# EAGLE schematic xdac+power_A (EAGLE 8.4.3)
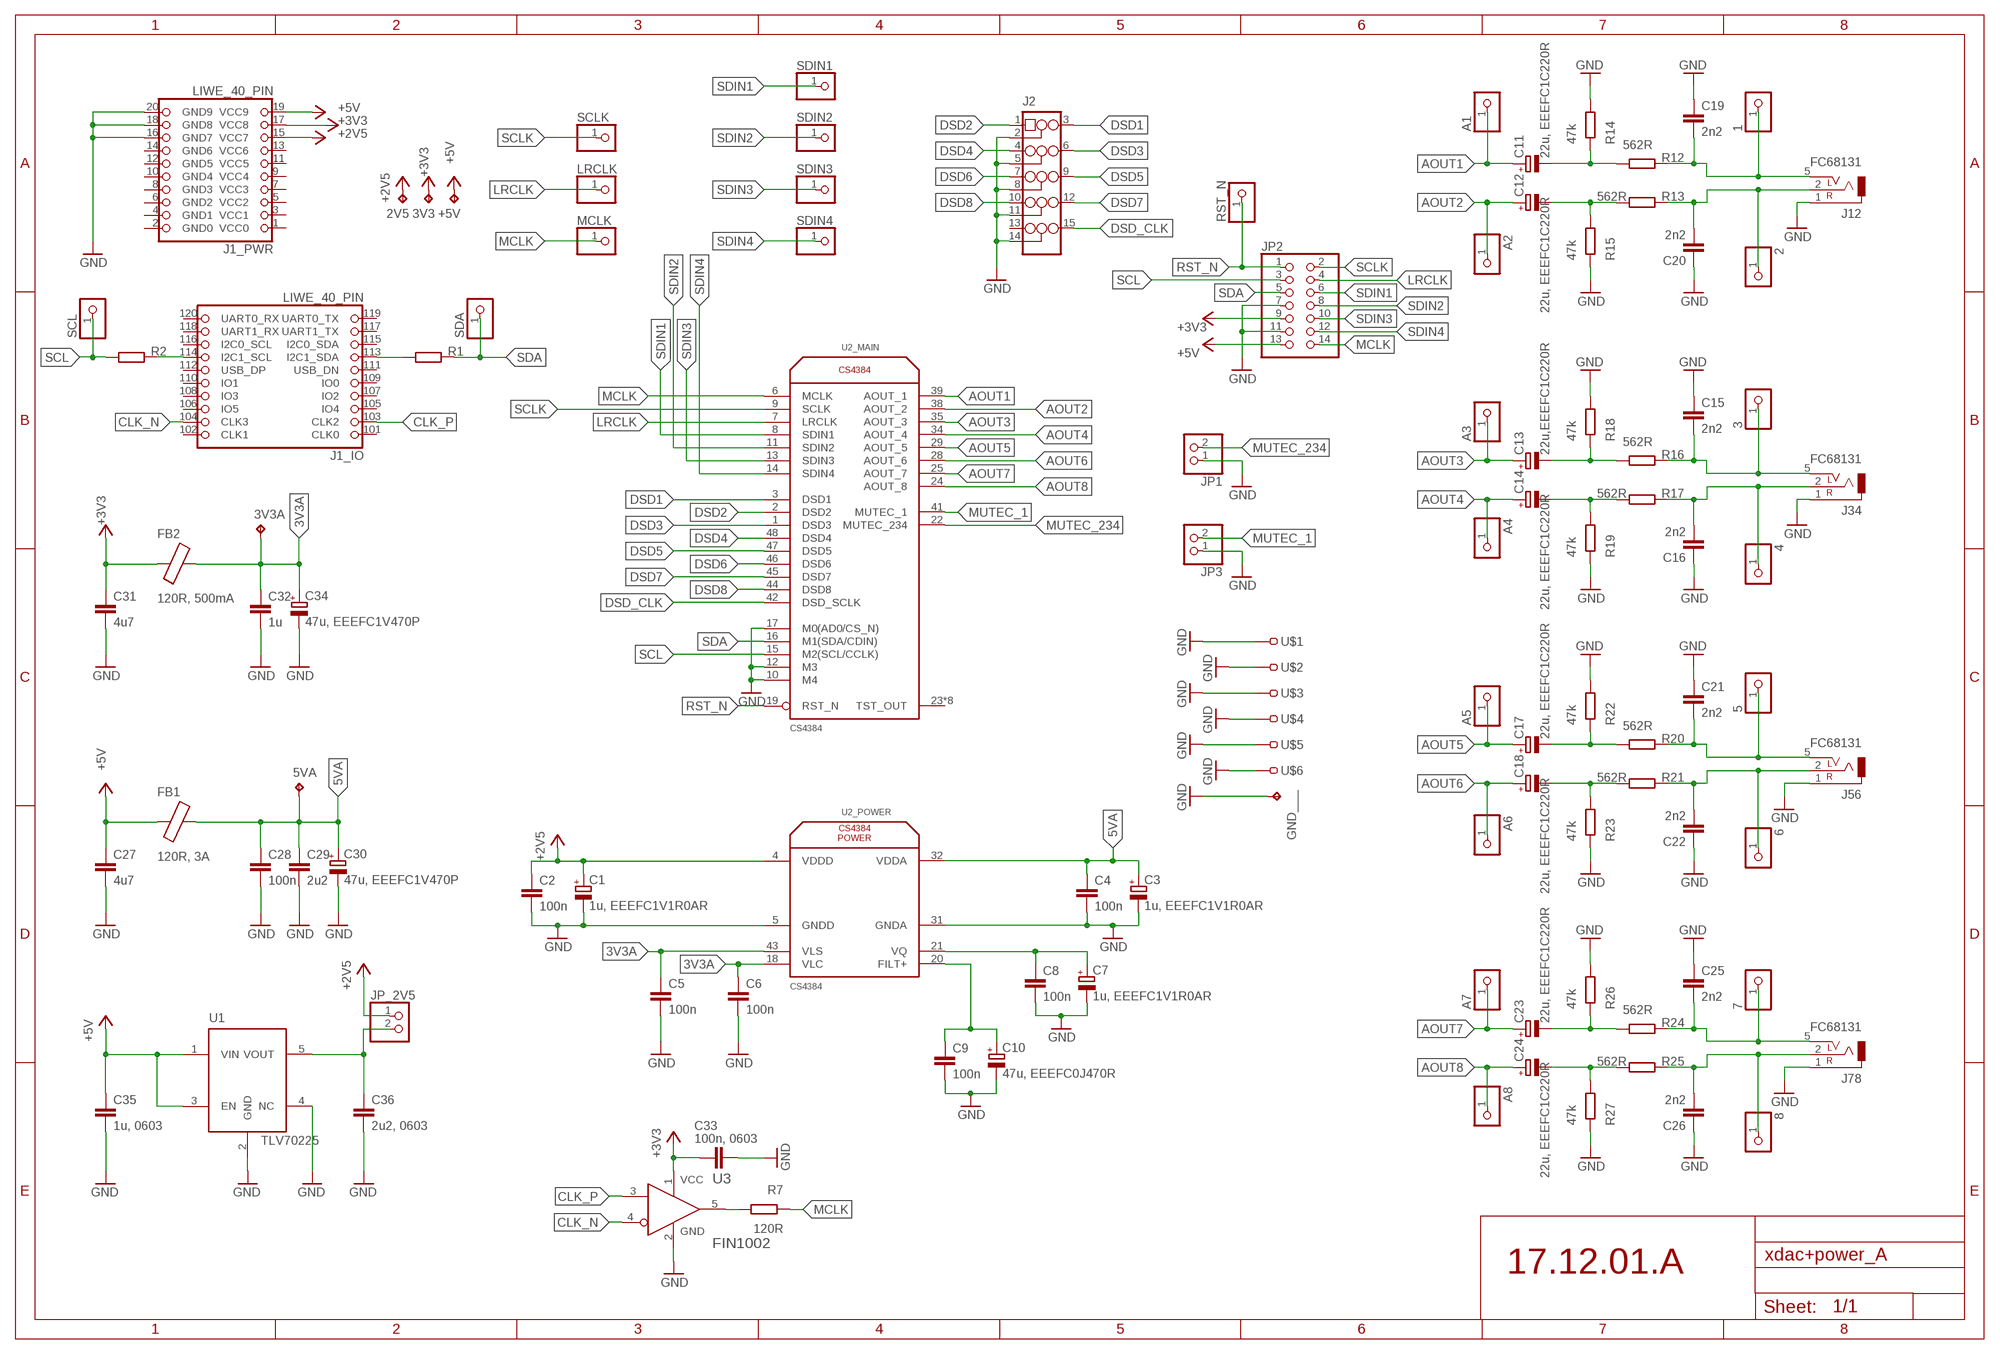
[diagram p0: schematic, sheet 1]

## Parts
1  PINHD-1X1  [1X01]
2  PINHD-1X1  [1X01]
2V5  TPTP14R  [TP14R]
3  PINHD-1X1  [1X01]
3V3  TPTP14R  [TP14R]
3V3A  TPTP14R  [TP14R]
4  PINHD-1X1  [1X01]
5  PINHD-1X1  [1X01]
5VA  TPTP14R  [TP14R]
6  PINHD-1X1  [1X01]
7  PINHD-1X1  [1X01]
8  PINHD-1X1  [1X01]
+5V  TPTP14R  [TP14R]
A1  PINHD-1X1  [1X01]
A2  PINHD-1X1  [1X01]
A3  PINHD-1X1  [1X01]
A4  PINHD-1X1  [1X01]
A5  PINHD-1X1  [1X01]
A6  PINHD-1X1  [1X01]
A7  PINHD-1X1  [1X01]
A8  PINHD-1X1  [1X01]
C1  1u, EEEFC1V1R0AR  C-POL_B  [EEE-FC1V1R0AR]
C2  100n  C-EUC0603  [C0603]
C3  1u, EEEFC1V1R0AR  C-POL_B  [EEE-FC1V1R0AR]
C4  100n  C-EUC0603  [C0603]
C5  100n  C-EUC0603  [C0603]
C6  100n  C-EUC0603K  [C0603K]
C7  1u, EEEFC1V1R0AR  C-POL_B  [EEE-FC1V1R0AR]
C8  100n  C-EUC0603  [C0603]
C9  100n  C-EUC0603  [C0603]
C10  47u, EEEFC0J470R  C-POL_C  [EEE-FC1C220R]
C11  22u, EEEFC1C220R  C-POL_C  [EEE-FC1C220R]
C12  22u, EEEFC1C220R  C-POL_C  [EEE-FC1C220R]
C13  22u,EEEFC1C220R  C-POL_C  [EEE-FC1C220R]
C14  22u, EEEFC1C220R  C-POL_C  [EEE-FC1C220R]
C15  2n2  C-EUC0603  [C0603]
C16  2n2  C-EUC0603  [C0603]
C17  22u, EEEFC1C220R  C-POL_C  [EEE-FC1C220R]
C18  22u, EEEFC1C220R  C-POL_C  [EEE-FC1C220R]
C19  2n2  C-EUC0603  [C0603]
C20  2n2  C-EUC0603  [C0603]
C21  2n2  C-EUC0603  [C0603]
C22  2n2  C-EUC0603  [C0603]
C23  22u, EEEFC1C220R  C-POL_C  [EEE-FC1C220R]
C24  22u, EEEFC1C220R  C-POL_C  [EEE-FC1C220R]
C25  2n2  C-EUC0603  [C0603]
C26  2n2  C-EUC0603  [C0603]
C27  4u7  C-EUC0603K  [C0603K]
C28  100n  C-EUC0603K  [C0603K]
C29  2u2  C-EUC0603K  [C0603K]
C30  47u, EEEFC1V470P  C-POL_E  [EEE-FC1V470P]
C31  4u7  C-EUC0603K  [C0603K]
C32  1u  C-EUC0603K  [C0603K]
C33  100n, 0603  C-EUC0603  [C0603]
C34  47u, EEEFC1V470P  C-POL_E  [EEE-FC1V470P]
C35  1u, 0603  C-EUC0603  [C0603]
C36  2u2, 0603  C-EUC0603  [C0603]
FB1  120R, 3A  FB_0603  [L0603]
FB2  120R, 500mA  FB_0603  [L0603]
GND___  TPTP14R  [TP14R]
J1  LIWE_40_PIN  [LIWE_40_PIN_8X8]
J2  PINHD-3X5/90  [3X05/90]
J12  FC68131  JACK_3.5_3P  [FC68131]
J34  FC68131  JACK_3.5_3P  [FC68131]
J56  FC68131  JACK_3.5_3P  [FC68131]
J78  FC68131  JACK_3.5_3P  [FC68131]
JP1  PINHD-1X2/90  [1X02/90]
JP2  PINHD-2X7  [2X07]
JP3  PINHD-1X2/90  [1X02/90]
JP_2V5  PINHD-1X2  [1X02]
LRCLK  PINHD-1X1  [1X01]
MCLK  PINHD-1X1  [1X01]
R1  R-EU_R0603  [R0603]
R2  R-EU_R0603  [R0603]
R7  120R  R-EU_R0603  [R0603]
R12  562R  R-EU_R0603  [R0603]
R13  562R  R-EU_R0603  [R0603]
R14  47k  R-EU_R0603  [R0603]
R15  47k  R-EU_R0603  [R0603]
R16  562R  R-EU_R0603  [R0603]
R17  562R  R-EU_R0603  [R0603]
R18  47k  R-EU_R0603  [R0603]
R19  47k  R-EU_R0603  [R0603]
R20  562R  R-EU_R0603  [R0603]
R21  562R  R-EU_R0603  [R0603]
R22  47k  R-EU_R0603  [R0603]
R23  47k  R-EU_R0603  [R0603]
R24  562R  R-EU_R0603  [R0603]
R25  562R  R-EU_R0603  [R0603]
R26  47k  R-EU_R0603  [R0603]
R27  47k  R-EU_R0603  [R0603]
RST_N  PINHD-1X1  [1X01]
SCL  PINHD-1X1  [1X01]
SCLK  PINHD-1X1  [1X01]
SDA  PINHD-1X1  [1X01]
SDIN1  PINHD-1X1  [1X01]
SDIN2  PINHD-1X1  [1X01]
SDIN3  PINHD-1X1  [1X01]
SDIN4  PINHD-1X1  [1X01]
U1  TLV70225  TLV702  [SOT-23-5]
U2  CS4384  [LQFP_48]
U3  FIN1002  [SOT95P280X140-5N]
U$1  TEST-22-MULTICOMP  [TEST_1MM]
U$2  TEST-22-MULTICOMP  [TEST_1MM]
U$3  TEST-22-MULTICOMP  [TEST_1MM]
U$4  TEST-22-MULTICOMP  [TEST_1MM]
U$5  TEST-22-MULTICOMP  [TEST_1MM]
U$6  TEST-22-MULTICOMP  [TEST_1MM]

## Nets
2V5_OUT: C36.1 JP_2V5.2 U1.5(VOUT)
3V3A: 3V3A.TP C5.1 C6.1 C32.1 C34.1(+) FB2.1 U2.18(_POWER:VLC) U2.43(_POWER:VLS)
5VA: 5VA.TP C3.1(+) C4.1 C28.1 C29.1 C30.1(+) FB1.1 U2.32(_POWER:VDDA)
+2V5: 2V5.TP C1.1(+) C2.1 J1.15(_PWR:VCC7) JP_2V5.1 U2.4(_POWER:VDDD)
+3V3: 3V3.TP C31.1 C33.2 FB2.2 J1.17(_PWR:VCC8) JP2.9 U3.1(VCC)
+5V: +5V.TP C27.1 C35.1 FB1.2 J1.19(_PWR:VCC9) JP2.13 U1.1(VIN) U1.3(EN)
AOUT1: A1.1 C11.1(+) U2.39(_MAIN:AOUT_1)
AOUT2: A2.1 C12.1(+) U2.38(_MAIN:AOUT_2)
AOUT2_: 2.1 C20.2 J12.2 R13.2
AOUT3: A3.1 C13.1(+) U2.35(_MAIN:AOUT_3)
AOUT3_: 3.1 C15.2 J34.5 R16.2
AOUT4: A4.1 C14.1(+) U2.34(_MAIN:AOUT_4)
AOUT4_: 4.1 C16.2 J34.2 R17.2
AOUT5: A5.1 C17.1(+) U2.29(_MAIN:AOUT_5)
AOUT5_: 5.1 C21.2 J56.5 R20.2
AOUT6: A6.1 C18.1(+) U2.28(_MAIN:AOUT_6)
AOUT6_: 6.1 C22.2 J56.2 R21.2
AOUT7: A7.1 C23.1(+) U2.25(_MAIN:AOUT_7)
AOUT7_: 7.1 C25.2 J78.5 R24.2
AOUT8: A8.1 C24.1(+) U2.24(_MAIN:AOUT_8)
AOUT8_: 8.1 C26.2 J78.2 R25.2
AUOT1_: 1.1 C19.2 J12.5 R12.2
CLK_N: J1.104(_IO:CLK3) U3.4(RIN-)
CLK_P: J1.103(_IO:CLK2) U3.3(RIN+)
DSD1: J2.3 U2.3(_MAIN:DSD1)
DSD2: J2.1 U2.2(_MAIN:DSD2)
DSD3: J2.6 U2.1(_MAIN:DSD3)
DSD4: J2.4 U2.48(_MAIN:DSD4)
DSD5: J2.9 U2.47(_MAIN:DSD5)
DSD6: J2.7 U2.46(_MAIN:DSD6)
DSD7: J2.12 U2.45(_MAIN:DSD7)
DSD8: J2.10 U2.44(_MAIN:DSD8)
DSD_CLK: J2.15 U2.42(_MAIN:DSD_SCLK)
FILT+: C9.1 C10.1(+) U2.20(_POWER:FILT+)
GND: C1.2(-) C2.2 C3.2(-) C4.2 C5.2 C6.2 C7.2(-) C8.2 C9.2 C10.2(-) C15.1 C16.1 C19.1 C20.1 C21.1 C22.1 C25.1 C26.1 C27.2 C28.2 C29.2 C30.2(-) C31.2 C32.2 C33.1 C34.2(-) C35.2 C36.2 GND___.TP J1.16(_PWR:GND7) J1.18(_PWR:GND8) J1.20(_PWR:GND9) J2.2 J2.5 J2.8 J2.11 J2.14 J12.1 J34.1 J56.1 J78.1 JP1.1 JP2.7 JP2.11 JP3.1 R14.2 R15.1 R18.2 R19.1 R22.2 R23.1 R26.2 R27.1 U1.2(GND) U1.4(NC) U2.5(_POWER:GNDD) U2.10(_MAIN:M4) U2.12(_MAIN:M3) U2.17(_MAIN:M0(AD0/CS_N)) U2.31(_POWER:GNDA) U3.2(GND) U$1.1 U$2.1 U$3.1 U$4.1 U$5.1 U$6.1
LRCLK: JP2.4 LRCLK.1 U2.7(_MAIN:LRCLK)
MCLK: JP2.14 MCLK.1 R7.1 U2.6(_MAIN:MCLK)
MUTEC_1: JP3.2 U2.41(_MAIN:MUTEC_1)
MUTEC_234: JP1.2 U2.22(_MAIN:MUTEC_234)
N$1: J1.113(_IO:I2C1_SDA) R1.1
N$2: J1.114(_IO:I2C1_SCL) R2.2
N$7: R7.2 U3.5(ROUT)
N$15: C11.2(-) R12.1 R14.1
N$16: C12.2(-) R13.1 R15.2
N$27: C13.2(-) R16.1 R18.1
N$28: C14.2(-) R17.1 R19.2
N$33: C17.2(-) R20.1 R22.1
N$34: C18.2(-) R21.1 R23.2
N$39: C23.2(-) R24.1 R26.1
N$40: C24.2(-) R25.1 R27.2
RST_N: JP2.1 RST_N.1 U2.19(_MAIN:RST_N)
SCL: JP2.3 R2.1 SCL.1 U2.15(_MAIN:M2(SCL/CCLK))
SCLK: JP2.2 SCLK.1 U2.9(_MAIN:SCLK)
SDA: JP2.5 R1.2 SDA.1 U2.16(_MAIN:M1(SDA/CDIN))
SDIN1: JP2.6 SDIN1.1 U2.8(_MAIN:SDIN1)
SDIN2: JP2.8 SDIN2.1 U2.11(_MAIN:SDIN2)
SDIN3: JP2.10 SDIN3.1 U2.13(_MAIN:SDIN3)
SDIN4: JP2.12 SDIN4.1 U2.14(_MAIN:SDIN4)
VQ: C7.1(+) C8.1 U2.21(_POWER:VQ)
Unconnected: J1.1(_PWR:VCC0) J1.2(_PWR:GND0) J1.3(_PWR:VCC1) J1.4(_PWR:GND1) J1.5(_PWR:VCC2) J1.6(_PWR:GND2) J1.7(_PWR:VCC3) J1.8(_PWR:GND3) J1.9(_PWR:VCC4) J1.10(_PWR:GND4) J1.11(_PWR:VCC5) J1.12(_PWR:GND5) J1.13(_PWR:VCC6) J1.14(_PWR:GND6) J1.101(_IO:CLK0) J1.102(_IO:CLK1) J1.105(_IO:IO4) J1.106(_IO:IO5) J1.107(_IO:IO2) J1.108(_IO:IO3) J1.109(_IO:IO0) J1.110(_IO:IO1) J1.111(_IO:USB_DN) J1.112(_IO:USB_DP) J1.115(_IO:I2C0_SDA) J1.116(_IO:I2C0_SCL) J1.117(_IO:UART1_TX) J1.118(_IO:UART1_RX) J1.119(_IO:UART0_TX) J1.120(_IO:UART0_RX) J2.13 U2.23(_MAIN:TST_OUT) U2.26(_MAIN:TST_OUT) U2.27(_MAIN:TST_OUT) U2.30(_MAIN:TST_OUT) U2.33(_MAIN:TST_OUT) U2.36(_MAIN:TST_OUT) U2.37(_MAIN:TST_OUT) U2.40(_MAIN:TST_OUT)

## Notes on the sheet
- 17.12.01.A

## Library data of the parts
1-8 A1-A8 LRCLK MCLK RST_N SCL SCLK SDA SDIN1-SDIN4 = 25pinhead:PINHD-1X1: PIN HEADER
2V5 3V3 3V3A 5VA +5V GND___ = testpad:TP: Test pad
C1 C3 C7 C10-C14 C17 C18 C23 C24 C30 C34 = 25cmsquare:C-POL: Panasonic Alluminium Electrolytic Capacitors / FC Series: FC Type: V http://www.farnell.com/datasheets/2059994.pdf?_ga=1.187970088.1293831445.1473845555
C2 C4-C6 C8 C9 C15 C16 C19-C22 C25-C29 C31-C33 C35 C36 = rcl:C-EU: CAPACITOR, European symbol
FB1 FB2 = 25cmsquare:FB
J1 = 25cmsquare:LIWE_40_PIN
J2 = 25pinhead:PINHD-3X5
J12 J34 J56 J78 = 25cmsquare:JACK_3.5_3P: CLIFF 3.5mm STEREO PC JACK SOCKET http://www.farnell.com/datasheets/2028381.pdf?_ga=1.192560682.1293831445.1473845555
JP1 JP3 = 25pinhead:PINHD-1X2: PIN HEADER
JP2 = 25pinhead:PINHD-2X7: PIN HEADER; SPICEPREFIX: X
JP_2V5 = pinhead:PINHD-1X2: PIN HEADER
R1 R2 R7 R12-R27 = rcl:R-EU_: RESISTOR, European symbol
U1 = 25cmsquare:TLV702
U2 = 25cmsquare:CS4384
U3 = 25cmsquare:FIN1002
U$1-U$6 = 25cmsquare:TEST-22-MULTICOMP: MULTICOMP TEST-22 TEST PIN, PCB, 1.0MM FARNELL: 1702010